# EAGLE design N-P-MOSFET-RG_adapter (EAGLE 8.3.2)
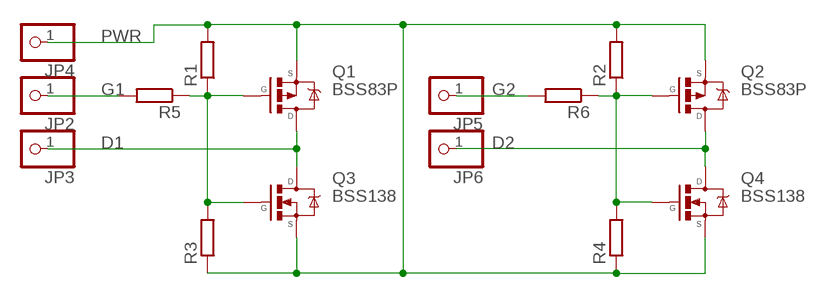
[diagram p0: schematic, sheet 1]

## Parts
JP2  PINHD-1X1JUST_PIN  [1X01_BARE]
JP3  PINHD-1X1JUST_PIN  [1X01_BARE]
JP4  PINHD-1X1JUST_PIN  [1X01_BARE]
JP5  PINHD-1X1JUST_PIN  [1X01_BARE]
JP6  PINHD-1X1JUST_PIN  [1X01_BARE]
Q1  BSS83P  [SOT23]
Q2  BSS83P  [SOT23]
Q3  BSS138  [SOT23]
Q4  BSS138  [SOT23]
R1  R-EU_R0805  [R0805]
R2  R-EU_R0805  [R0805]
R3  R-EU_R0805  [R0805]
R4  R-EU_R0805  [R0805]
R5  R-EU_R0805  [R0805]
R6  R-EU_R0805  [R0805]

## Nets
D1: JP3.1 Q1.3(D) Q3.3(D)
D2: JP6.1 Q2.3(D) Q4.3(D)
G1: JP2.1 R5.2
G2: JP5.1 R6.2
N$3: Q2.1(G) Q4.1(G) R2.1 R4.2 R6.1
N$4: Q1.1(G) Q3.1(G) R1.1 R3.2 R5.1
PWR: JP4.1 Q1.2(S) Q2.2(S) Q3.2(S) Q4.2(S) R1.2 R2.2 R3.1 R4.1

## Library data of the parts
JP2-JP6 = my-pinhead:PINHD-1X1: PIN HEADER
Q1 Q2 = my-mosfet:BSS83P: P-Channel Enhancement Mode Transistor
Q3 Q4 = my-mosfet:BSS138: N-Channel Enhancement Mode Transistor
R1-R6 = rcl:R-EU_: RESISTOR, European symbol

## Board
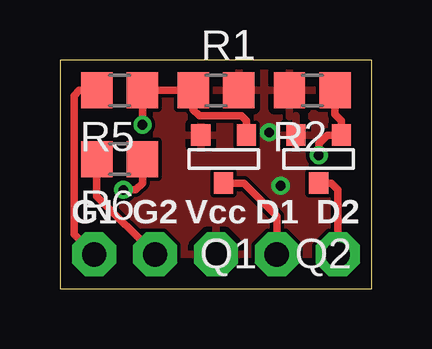
[diagram p1: board, top side]
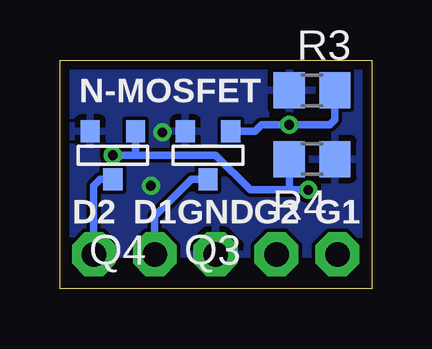
[diagram p2: board, bottom side, seen from below]

Size 13.01 x 9.53 mm. Coordinates in mm from the lower left corner, seen from the top.
Outline: 0,0 13.01,0 13.01,9.53 0,9.53 0,0
Copper layers (1*16): Top 0.0356mm / dielectric 1.5011mm / Bottom 0.0356mm
Design rules "PCBs_io *": minimum track width 6mil, minimum drill 13mil, track to track 6mil, track to pad 6mil, pad to pad 6mil, via to via 6mil, smd to smd 6mil, copper to edge 15mil, drill to drill 6mil, minimum pad ring 16mil, minimum via ring 7mil, stop-mask expansion 3mil, vias tented up to drill 0.6mm, thermal gap 10mil

### Footprints (pad centres in the part's own frame; a part is rotated, then mirrored left to right if it is on the bottom)
1X01_BARE = drill 1.016 octagon: 1 0,0
SOT23 = smd 0.8 x 0.9: 1 -0.95,-1; 2 0.95,-1; 3 0,1
R0805 = smd 1.3 x 1.5: 1 -0.95,0; 2 0.95,0

### Placement (x,y rotation side)
JP2  1.43,1.43 0 bottom
JP3  9.05,1.43 0 bottom
JP4  6.51,1.43 0 bottom
JP5  3.97,1.43 0 bottom
JP6  11.59,1.43 0 bottom
Q1  6.83,5.4 180 top
Q2  10.79,5.4 180 top
Q3  6.83,5.56 180 bottom
Q4  10.79,5.56 180 bottom
R1  6.51,8.26 0 top
R2  10.53,8.26 180 top
R3  2.49,8.26 0 bottom
R4  2.49,5.4 180 bottom
R5  2.49,8.26 180 top
R6  2.49,5.4 180 top

### Tracks (layer width: path | path; a pad name or v marks a point on that pad's centre or on a via)
D1
  Top 0.305: JP3.1 9.05,3.02 7.67,4.4 Q1.3
  Bottom 0.305: JP3.1 9.05,3.02 7.51,4.56 Q3.3
D2
  Top 0.305: JP6.1 11.59,4.13 11.32,4.4 Q2.3
  Bottom 0.305: JP6.1 11.59,4.29 11.32,4.56 Q4.3
G1
  Top 0.305: JP2.1 0.58,2.27 0.58,8.04 0.79,8.26 R5.2
G2
  Top 0.305: R6.2 1.54,3.86 JP5.1
N$1
  cutout Top: 0.16,1.11 10.79,1.11 13.02,1.11 13.02,0 0,0 0,1.11
N$2
  cutout Bottom: 0.16,1.11 13.02,1.11 13.02,0 0,0 0,1.11
N$3  (via drill 0.4)
  Top 0.305: R2.1 11.48,7.25 11.74,6.99 Q2.1 11.16,6.4 10.79,6.03 v10.79,5.56 | v2.65,4.12 3.16,4.12 3.44,4.39 R6.1
  Bottom 0.305: 9.84,5.56 6.51,5.56 5.07,4.12 3.49,4.12 | 9.84,5.56 v10.79,5.56 | 9.84,5.56 9.85,5.56 Q4.1 | 3.49,4.12 v2.65,4.12 | R6.1 3.44,4.17 3.49,4.12
N$4  (via drill 0.4)
  Top 0.305: R1.1 R5.1 v3.44,6.83 | R1.1 | R1.1 5.56,7.46 5.82,7.2 7.56,7.2 7.78,6.99 Q1.1 | Q1.1
  Bottom 0.305: R3.2 1.54,7.03 1.75,6.83 v3.44,6.83 4.6,6.83 4.87,6.56 Q3.1
PWR  (via drill 0.4)
  other vias: 8.73,6.51 9.21,4.29
  pour Top: -0.16,9.53 0,0 13.02,0 13.02,9.53
  pour Bottom: 0,9.53 0,0 13.02,0 13.02,9.53

### Text on the board
tPlace: G1 | G2 | Vcc | D1 | D2
bPlace: N-MOSFET | G1 | G2 | GND | D1 | D2